# Altium schematic sheet Sheet1-Renamed123.SchDoc
size A
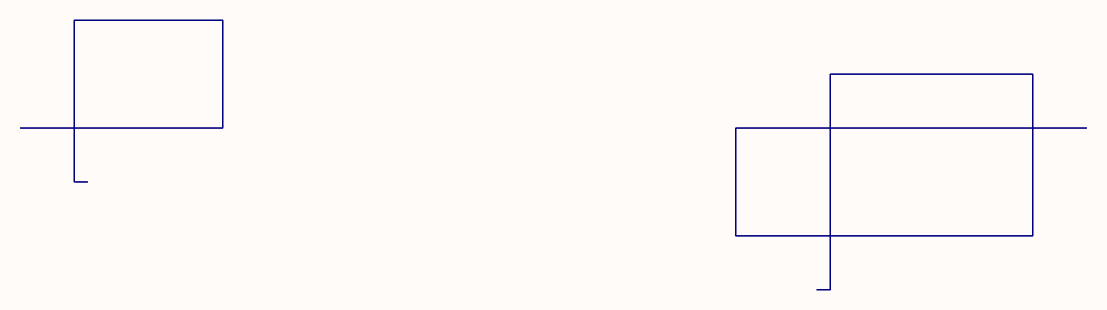
[diagram p0: Sheet1-Renamed123.SchDoc]